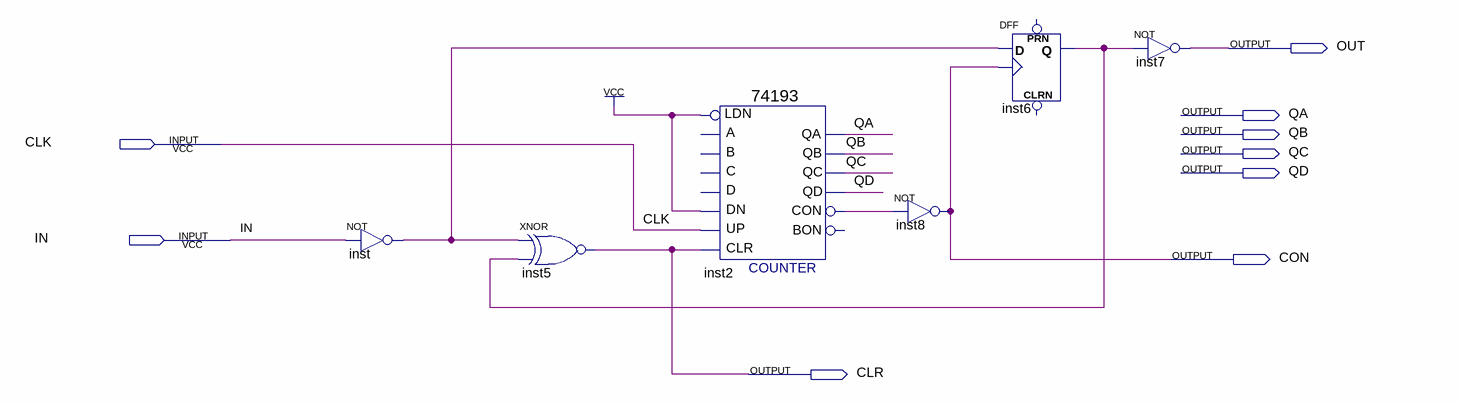
[diagram p0: schematic sheet]
// Quartus schematic max68.bdf as structural Verilog: 6 symbols, 9 pins
module max68 (
  input  CLK,
  input  IN,
  output OUT,
  output QA,
  output QB,
  output QC,
  output QD,
  output CON,
  output CLR
);

  wire inst2_con, inst6_q, inst_out;

  not inst (inst_out, IN);
  xnor inst5 (CLR, inst_out, inst6_q);
  \74193  inst2 (
    .CLR(CLR), .UP(CLK), .DN(1'b1), .LDN(1'b1), .QB(QB), .QA(QA), .CON(inst2_con), .QD(QD), .QC(QC));  // open: D, C, B, A, BON
  not inst8 (CON, inst2_con);
  DFF inst6 (.CLK(CON), .D(inst_out), .Q(inst6_q));  // open: CLRN, PRN
  not inst7 (OUT, inst6_q);
endmodule
